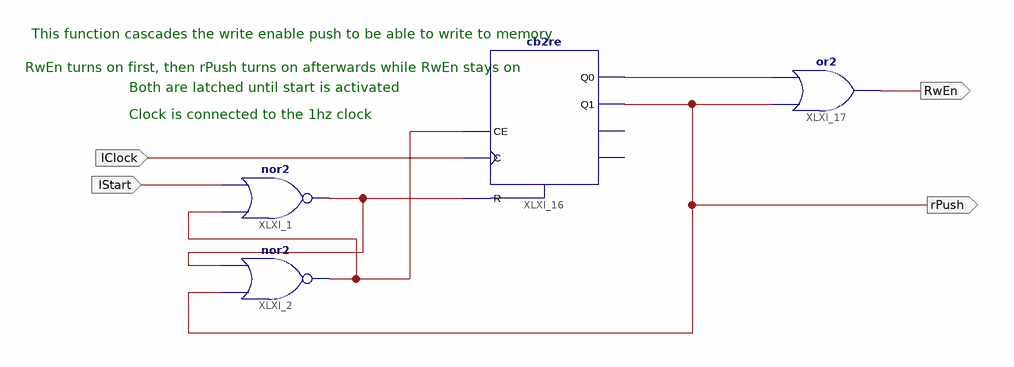
[diagram p0: schematic sheet 1]
// Xilinx ISE schematic MemWrite.sch (spartan3e) as structural Verilog: 4 symbols, 4 ports
module MemWrite (
  input  lStart,
  input  lClock,
  output RwEn,
  output rPush
);

  wire XLXN_18, XLXN_19, XLXN_20;

  nor XLXI_1 (XLXN_19, XLXN_20, lStart);
  nor XLXI_2 (XLXN_20, rPush, XLXN_19);
  cb2re XLXI_16 (.C(lClock), .CE(XLXN_20), .R(XLXN_19), .Q0(XLXN_18), .Q1(rPush));  // open: CEO, TC
  or XLXI_17 (RwEn, rPush, XLXN_18);

  // Notes on the sheet:
  //   This function cascades the write enable push to be able to write to memory
  //   RwEn turns on first, then rPush turns on afterwards while RwEn stays on
  //   Both are latched until start is activated
  //   Clock is connected to the 1hz clock
endmodule
